# Altium schematic sheet BLE.SchDoc
size A4; SheetNumber: 1; SheetTotal: 3
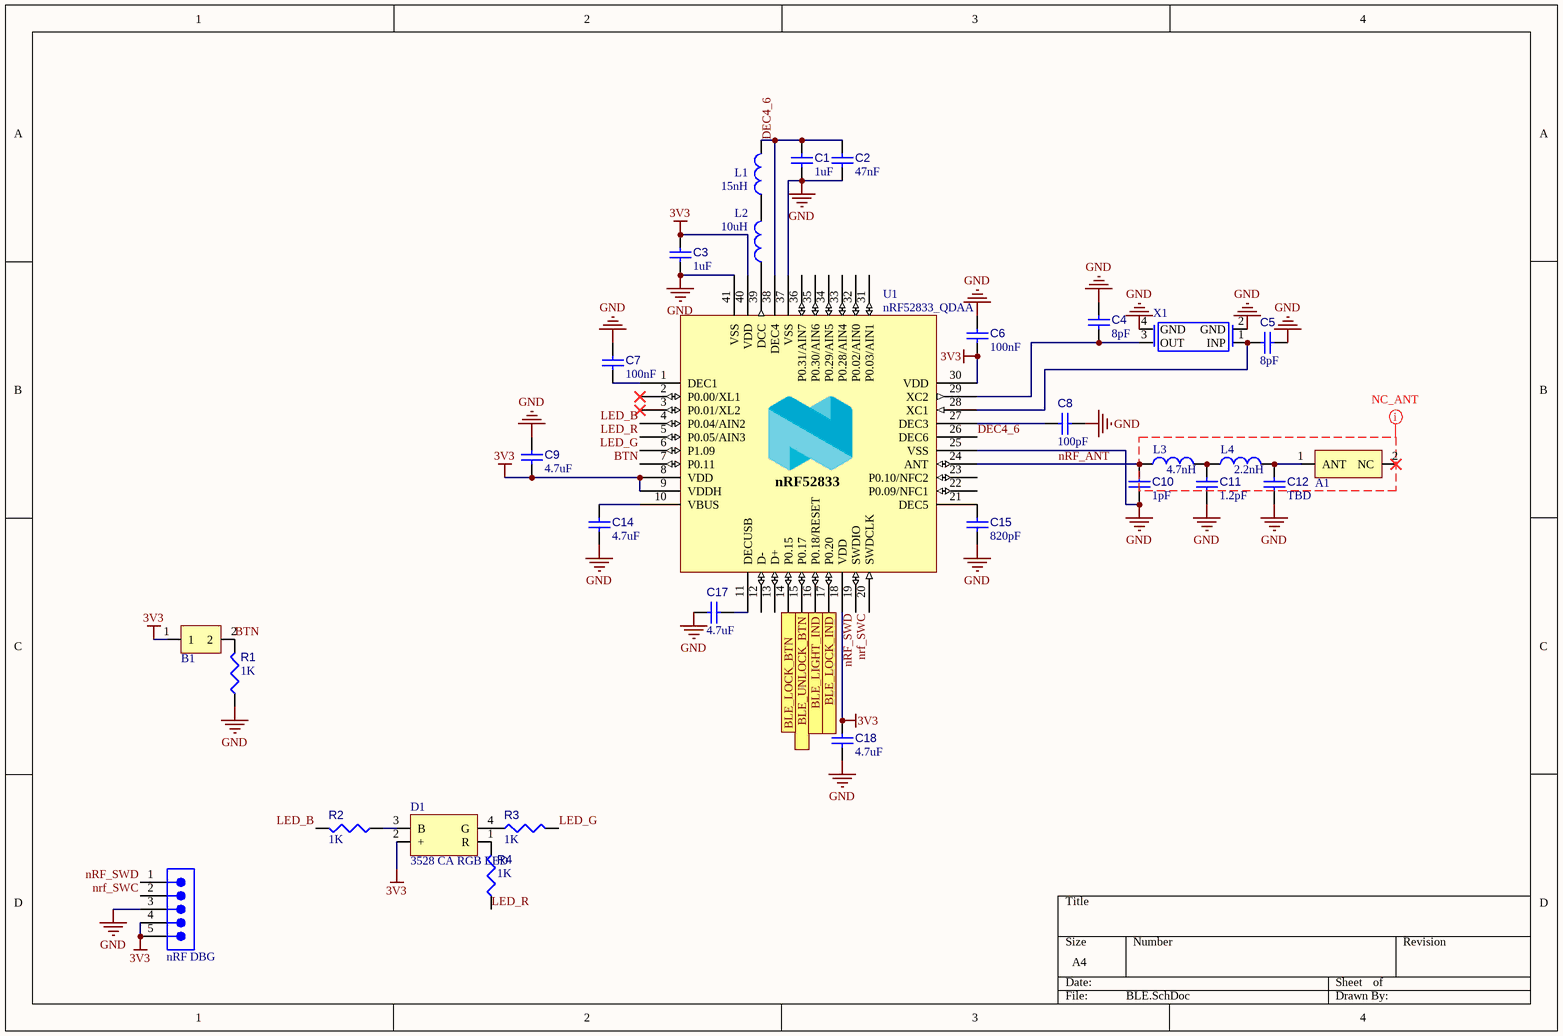
[diagram p0: BLE.SchDoc]

## Parts
A1  RFANT3216120A1T  [INDC3216X13L]  (value not drawn)
B1  B3U-1000P  [2.5*4 BTN]  (value not drawn)
C1  value 1uF  [CAPC1005X55X25LL05T05]  (hidden comment: CL05A105KA5NQNC)
C2  value 47nF  [CAPC1005X55X25LL05T05]  (hidden comment: CL05B473KB5VPNC)
C3  value 1uF  [CAPC1005X55X25LL05T05]  (hidden comment: CL05A105KA5NQNC)
C4  value 8pF  [CAPC1005X55X25LL05T05]  (hidden comment: CL05C080DB5NNNC)
C5  value 8pF  [CAPC1005X55X25LL05T05]  (hidden comment: CL05C080DB5NNNC)
C6  value 100nF  [CAPC1005X55X25LL05T05]  (hidden comment: CL05B104KB5NNNC)
C7  value 100nF  [CAPC1005X55X25LL05T05]  (hidden comment: CL05B104KB5NNNC)
C8  value 100pF  [CAPC1005X55X25LL05T05]  (hidden comment: CL05C101JB5NNNC)
C9  value 4.7uF  [CAPC1005X55X25LL05T05]  (hidden comment: CL05A475MQ5NRNC)
C10  value 1pF  [CAPC1005X55X25LL05T05]  (hidden comment: CL05C010CB5NNNC)
C11  value 1.2pF  [CAPC1005X55X25LL05T05]  (hidden comment: CL05C1R2BB5NNNC)
C12  value TBD  [CAPC1005X55X25LL05T05]  (hidden comment: 0402 Capacitor)
C14  value 4.7uF  [CAPC1005X55X25LL05T05]  (hidden comment: CL05A475MQ5NRNC)
C15  value 820pF  [CAPC1005X55X25LL05T05]  (hidden comment: CL05B821KB5NNNC)
C17  value 4.7uF  [CAPC1005X55X25LL05T05]  (hidden comment: CL05A475MQ5NRNC)
C18  value 4.7uF  [CAPC1005X55X25LL05T05]  (hidden comment: CL05A475MQ5NRNC)
D1  3528 CA RGB LED  [3528 CA RGB LED]
L1  value 15nH  [INDC1005X06L]  (hidden comment: SDCL1005C15NJTDF)
L2  value 10uH  [INDC1608X10L]  (hidden comment: LQM18FN100M00D)
L3  value 4.7nH  [INDC1005X06L]  (hidden comment: SDCL1005C4N7STDF)
L4  value 2.2nH  [INDC1005X06L]  (hidden comment: SDCL1005C2N2STDF)
nRF_DBG  653005114822  [653005114822]  (value not drawn)
R1  value 1K  [RESC1005X40X25LL05T05]  (hidden comment: 1K 0402)
R2  value 1K  [RESC1608X55X25LL10T15]  (hidden comment: 1K 0603)
R3  value 1K  [RESC1608X55X25LL10T15]  (hidden comment: 1K 0603)
R4  value 1K  [RESC1608X55X25LL10T15]  (hidden comment: 1K 0603)
U1  nRF52833_QDAA  [QFN40P500X500X50_HS-41N]
X1  X201632MKB4SI  [XTAL_2016]  (value not drawn)

## Ports
BLE_LIGHT_IND (see Connector[3C]), BLE_LOCK_BTN (see Connector[2C]), BLE_LOCK_IND (see Connector[3C]), BLE_UNLOCK_BTN (see Connector[2C])

## Nets
3V3: B1.1 C3.2 C6.1 C9.1 C18.1 D1.2(+) nRF_DBG.4 nRF_DBG.5 U1.8(VDD) U1.9(VDDH) U1.18(VDD) U1.30(VDD) U1.40(VDD)
GND: C1.1 C2.1 C3.1 C4.2 C5.1 C6.2 C7.2 C8.2 C9.2 C10.1 C11.1 C12.1 C14.1 C15.1 C17.1 C18.2 nRF_DBG.3 R1.1 U1.25(VSS) U1.37(VSS) U1.41(VSS) X1.2(GND) X1.4(GND)
BLE_LIGHT_IND: U1.16(P0.18/RESET) ; port BLE_LIGHT_IND
BLE_LOCK_BTN: U1.14(P0.15) ; port BLE_LOCK_BTN
BLE_LOCK_IND: U1.17(P0.20) ; port BLE_LOCK_IND
BLE_UNLOCK_BTN: U1.15(P0.17) ; port BLE_UNLOCK_BTN
BTN: B1.2 R1.2 U1.7(P0.11)
DEC4_6: C1.2 C2.2 L1.2 U1.26(DEC6) U1.38(DEC4)
LED_B: R2.2 U1.4(P0.04/AIN2)
LED_G: R3.2 U1.6(P1.09)
LED_R: R4.1 U1.5(P0.05/AIN3)
nRF_ANT: C10.2 L3.1 U1.24(ANT)
nrf_SWC: nRF_DBG.2 U1.20(SWDCLK)
nRF_SWD: nRF_DBG.1 U1.19(SWDIO)
NetA1_1: A1.1(ANT) C12.2 L4.2
NetC4_1: C4.1 U1.29(XC2) X1.3(OUT)
NetC5_2: C5.2 U1.28(XC1) X1.1(INP)
NetC7_1: C7.1 U1.1(DEC1)
NetC8_1: C8.1 U1.27(DEC3)
NetC11_2: C11.2 L3.2 L4.1
NetC14_2: C14.2 U1.10(VBUS)
NetC15_2: C15.2 U1.21(DEC5)
NetC17_2: C17.2 U1.11(DECUSB)
NetD1_1: D1.1(R) R4.2
NetD1_3: D1.3(B) R2.1
NetD1_4: D1.4(G) R3.1
NetL1_1: L1.1 L2.2
NetL2_1: L2.1 U1.39(DCC)

Not connected (* = marked no-connect by the designer): A1 2(NC)*; U1 2(P0.00/XL1)* 3(P0.01/XL2)* 12(D-) 13(D+) 22(P0.09/NFC1) 23(P0.10/NFC2) 31(P0.03/AIN1) 32(P0.02/AIN0) 33(P0.28/AIN4) 34(P0.29/AIN5) 35(P0.30/AIN6) 36(P0.31/AIN7)

## Layout directives
net class NC_ANT: (no net found under the mark)

## Notes on the sheet
- (in symbol nRF52833_QDAA) nRF52833

## Library data of the parts
A1 = RFANT3216120A1T: 2450Mhz 50Mhz Ceramic Antenna; Pins: 2; Type: Antenna
B1 = B3U-1000P: 2.5x4 Ultra-small Tactile Switch; Pins: 2; Type: Button
C1 C3 = CL05A105KA5NQNC: Non-Polarized Capacitor Symbol; Tolerance: 10%; Voltage Rating: 25V; Capacitor Type: Ceramic; Type: X5R; Case/Size Code: 0402
C2 = CL05B473KB5VPNC: Non-Polarized Capacitor Symbol; Tolerance: 10%; Voltage Rating: 50V; Capacitor Type: Ceramic; Type: X7R; Case/Size Code: 0402
C4 C5 = CL05C080DB5NNNC: Non-Polarized Capacitor Symbol; Tolerance: 0.5pF; Voltage Rating: 50V; Capacitor Type: Ceramic; Type: C0G; Case/Size Code: 0402
C6 C7 = CL05B104KB5NNNC: Non-Polarized Capacitor Symbol; Tolerance: 10%; Voltage Rating: 50V; Capacitor Type: Ceramic; Type: X7R; Case/Size Code: 0402
C8 = CL05C101JB5NNNC: Non-Polarized Capacitor Symbol; Tolerance: 5%; Voltage Rating: 50V; Capacitor Type: Ceramic; Type: C0G; Case/Size Code: 0402
C9 C14 C17 C18 = CL05A475MQ5NRNC: Non-Polarized Capacitor Symbol; Tolerance: 20%; Voltage Rating: 6.3V; Capacitor Type: Ceramic; Type: X5R; Case/Size Code: 0402
C10 = CL05C010CB5NNNC: Non-Polarized Capacitor Symbol; Tolerance: 0.25pF; Voltage Rating: 50V; Capacitor Type: Ceramic; Type: C0G; Case/Size Code: 0402
C11 = CL05C1R2BB5NNNC: Non-Polarized Capacitor Symbol; Tolerance: 0.1pF; Voltage Rating: 50V; Capacitor Type: Ceramic; Type: C0G; Case/Size Code: 0402
C12 = 0402 Capacitor: Non-Polarized Capacitor Symbol; Capacitor Type: Ceramic; Case/Size Code: 0402; Tolerance: TBD; Voltage Rating: TBD; Type: TBD
C15 = CL05B821KB5NNNC: Non-Polarized Capacitor Symbol; Tolerance: 10%; Voltage Rating: 50V; Capacitor Type: Ceramic; Type: X7R; Case/Size Code: 0402
D1 = 3528 CA RGB LED: 3528 Common Anode RGB LED; Package: 3528; Pin: 4; Type: LED
L1 = SDCL1005C15NJTDF: HF inductor; Case/Size Code: 0402; Pins: 2
L2 = LQM18FN100M00D: Chip Coil inductor 50mA 20% 10uH; Case/Size Code: 0603; Pins: 2
L3 = SDCL1005C4N7STDF: 4.7nH ±0.3nH 300mA HF; Case/Size Code: 0402; Pins: 2
L4 = SDCL1005C2N2STDF: HF inductor; Case/Size Code: 0402; Pins: 2
nRF_DBG = 653005114822: WR-WTB THT Male Vertical Shrouded Header, pitch 1.25mm, 5pins; Manufacturer: Wurth Elektronik; Contact Resistance: 20mOhm; Rated Current: 1A; Working Voltage: 125VAC; Withstanding Voltage: 250VAC; Manufacturer Part Number: 653005114822; Category: Wire-to-Board Connectors; Match Code: WR-WTB; ComponentLink1Description: Website Link; ComponentLink1URL: https://www.we-online.com/redexpert/article/653005114822?ad; ComponentLink2Description: Datasheet Link; ComponentLink2URL: https://www.we-online.com/redexpert/spec/653005114822?ad; Mount: Through Hole; Operating Temperature Max: 85°C; Operating Temperature Min: -40°C; Packaging: Tube; Length: 8mm; Width: 3.2mm; Height: 4.2mm; Gender: Male; Number of Pins: 5; Number of Rows: 1; Orientation: Vertical; Pitch: 1.25mm
R1 = 1K 0402: 0402 Chip Resistor; Case/Size Code: 0402; Pins: 2
R2-R4 = 1K 0603: 0603 Chip Resistor; Case/Size Code: 0603; Pins: 2
U1 = nRF52833_QDAA: Multi-protocol Bluetooth Low Energy, IEEE 802.15.4, ANT and 2.4GHz proprietary system-on-chip; Package: QFN40
X1 = X201632MKB4SI: 32MHz ±10ppm 8pF; Load Capacitance: 8pF; Frequency: 32Mhz; Frequency Tolerance: 10ppm; Pins: 4